# Altium schematic sheet ANALOG-PART.SchDoc: ANALOG SIGNAL DEV-BOARD
size A2; DrawnBy: Luca Schenetti; Revision: V1.0; SheetNumber: 4; SheetTotal: 4
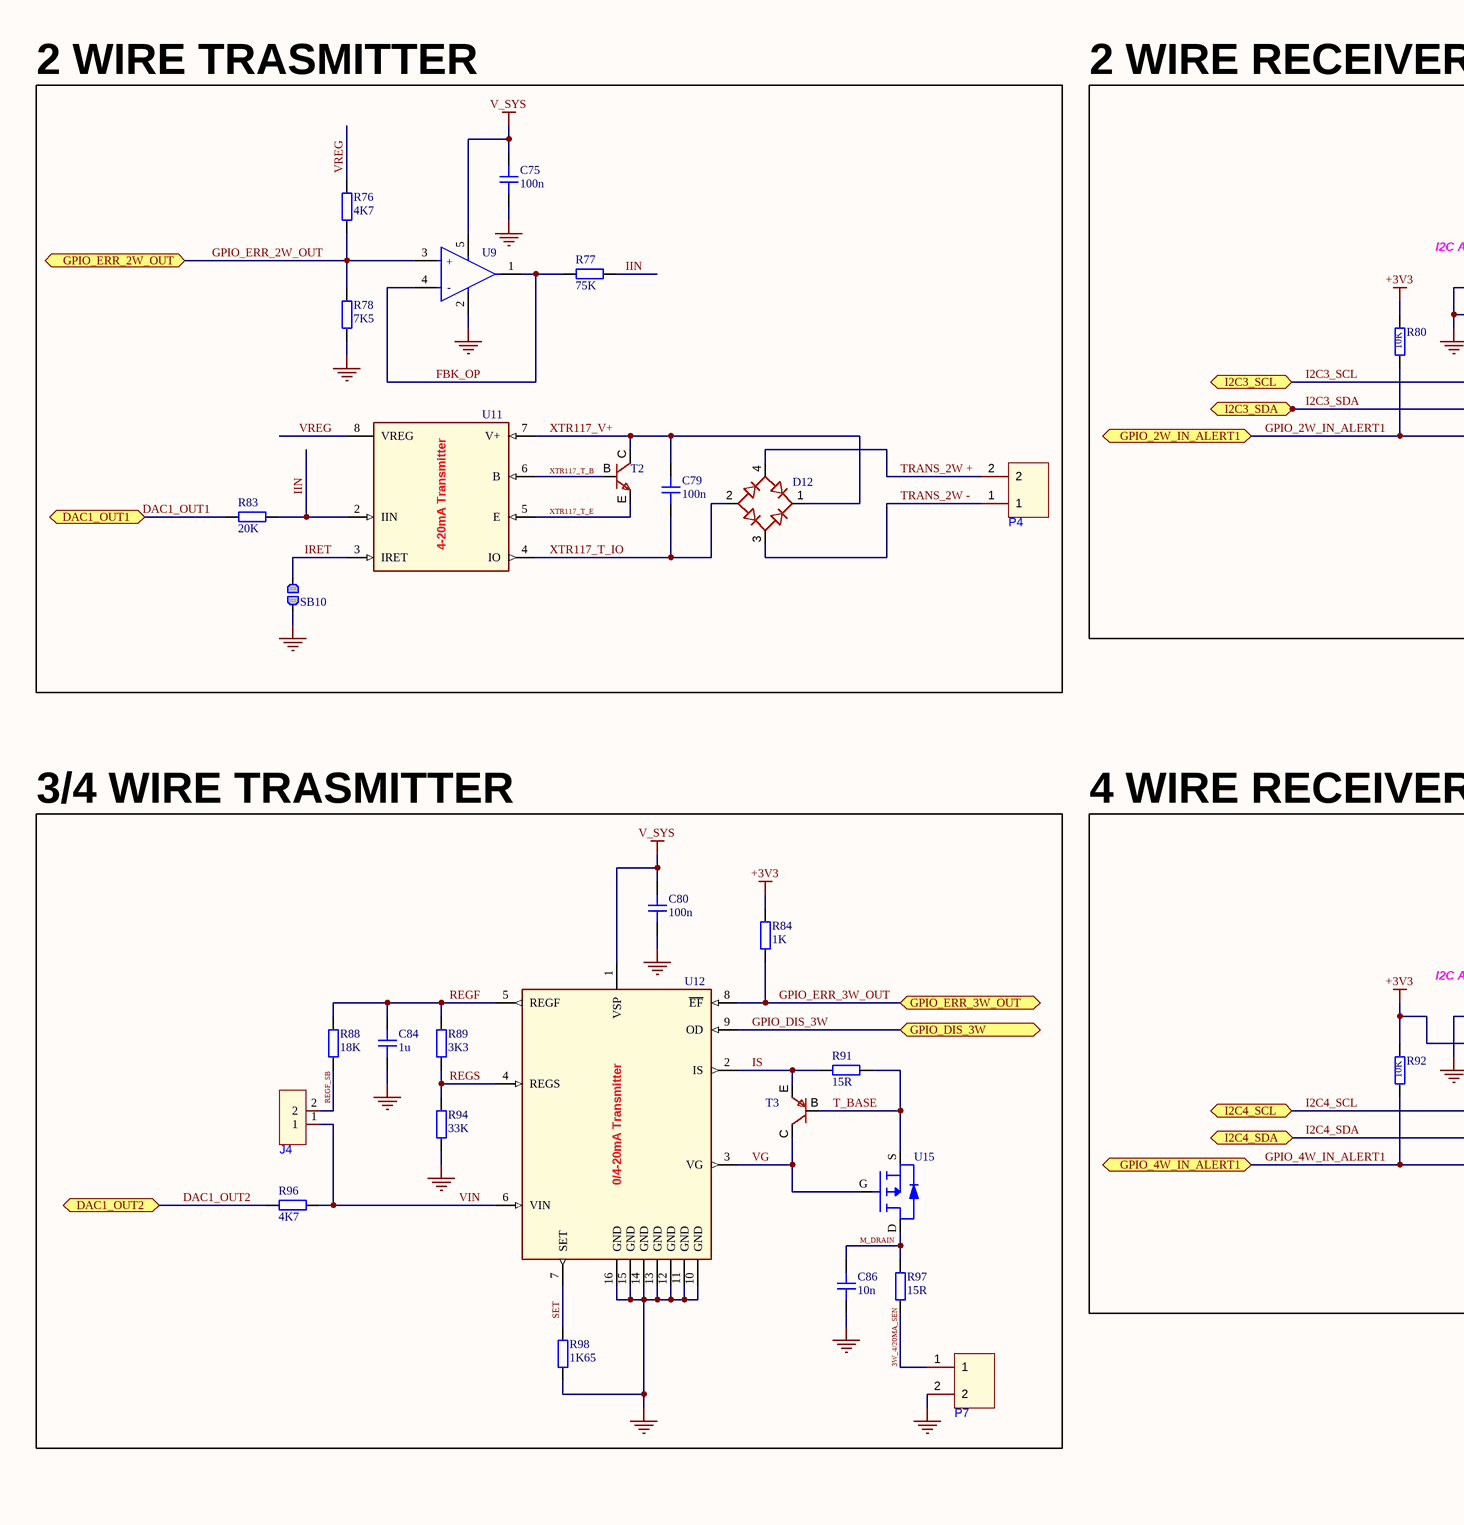
[diagram p0: ANALOG-PART.SchDoc, left]
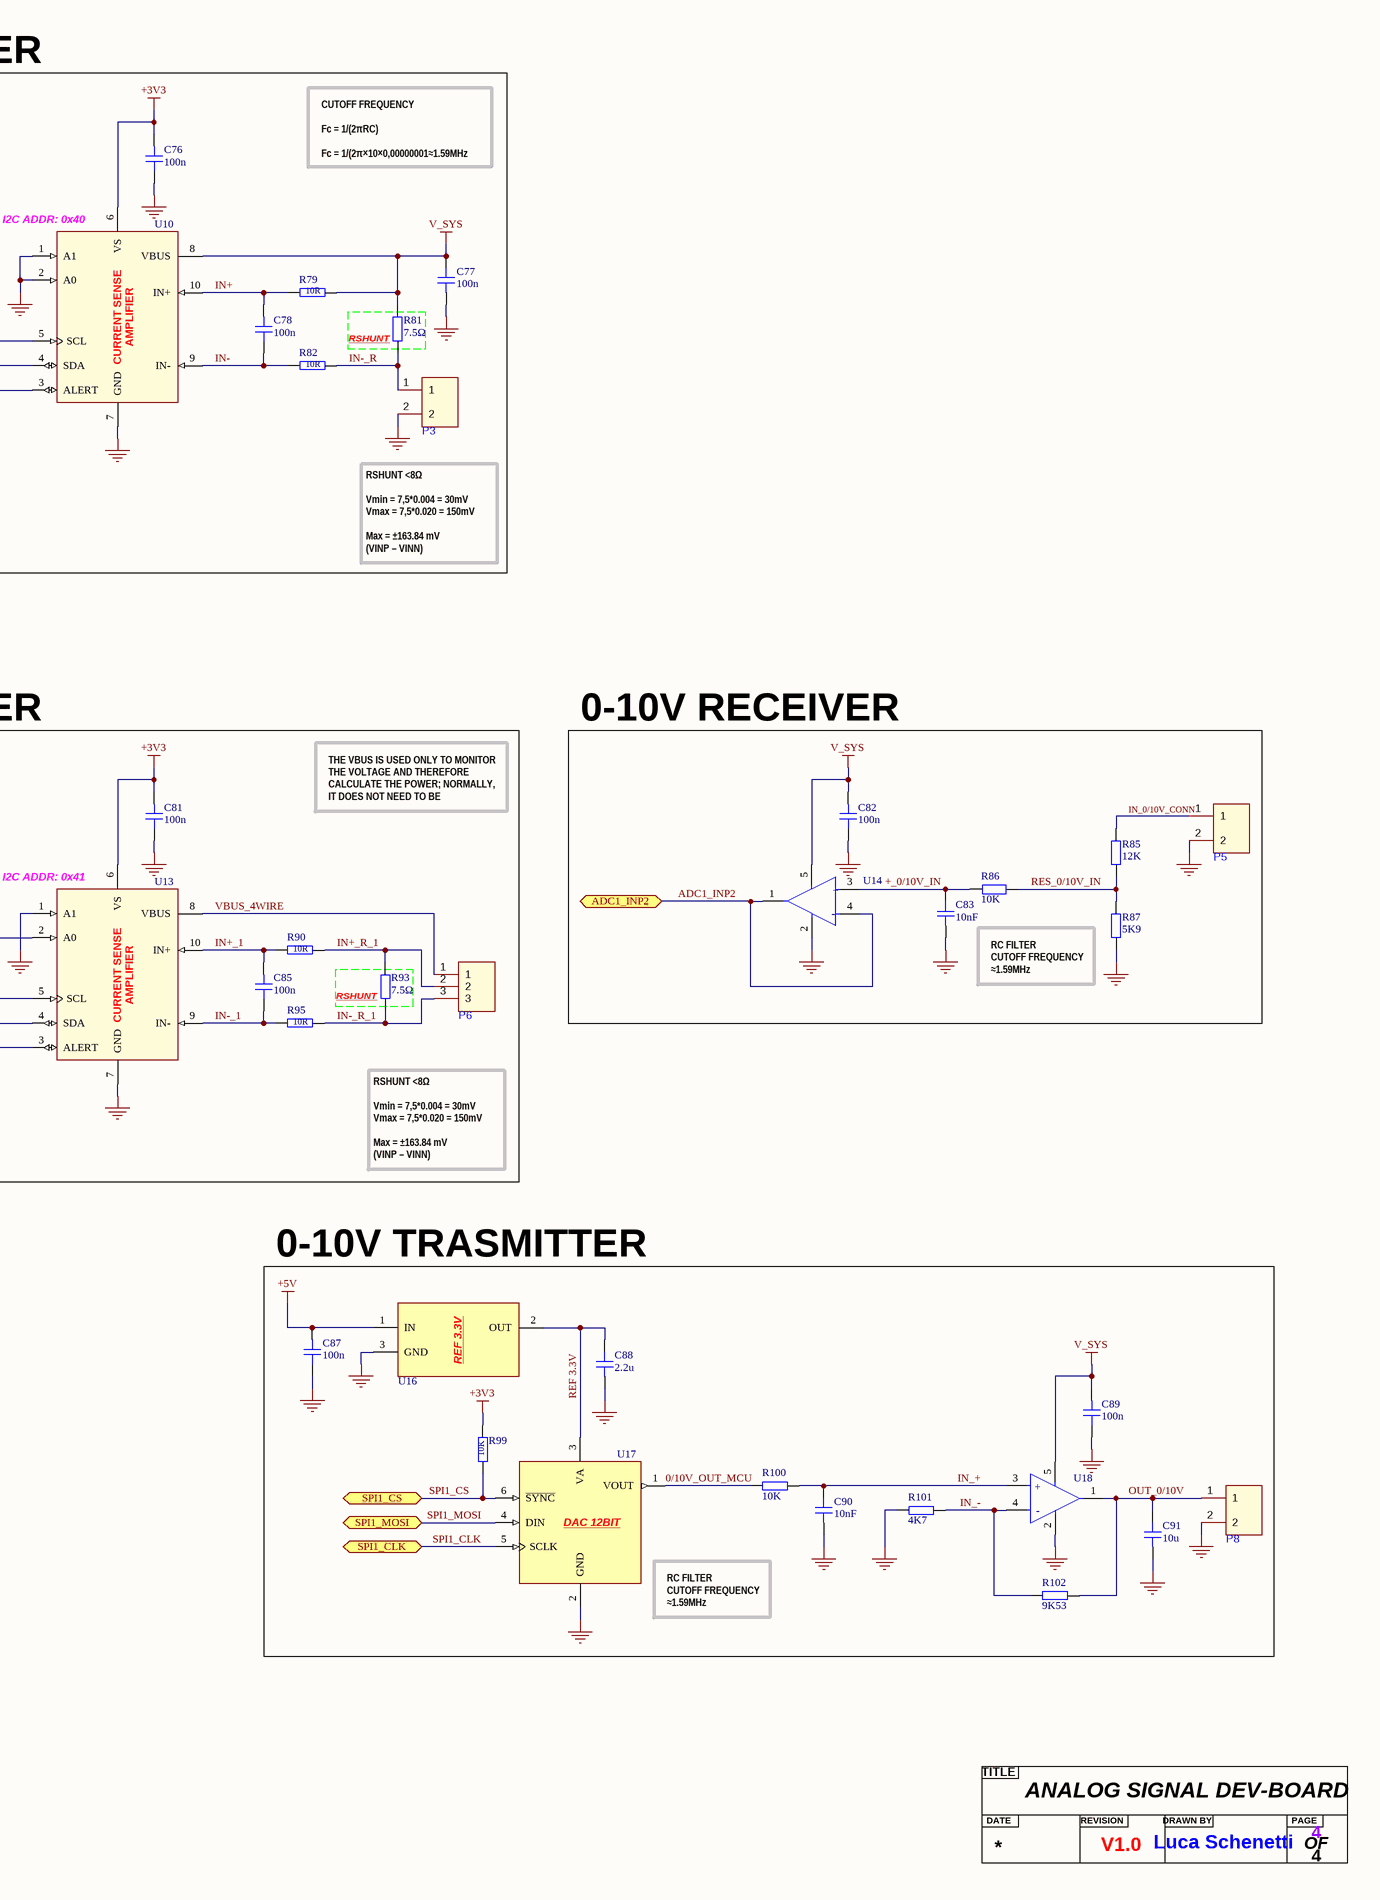
[diagram p1: ANALOG-PART.SchDoc, right]

## Parts
?  Title  (value not drawn)  (graphical)
C75  100n  [CAP_0603]
C76  100n  [CAP_0603]
C77  100n  [CAP_0603]
C78  100n  [CAP_0603]
C79  100n  [CAP_0603]
C80  100n  [CAP_0603]
C81  100n  [CAP_0603]
C82  100n  [CAP_0603]
C83  10nF  [CAP_0603]
C84  1u  [CAP_0603]
C85  100n  [CAP_0603]
C86  10n  [CAP_0603]
C87  100n  [CAP_0603]
C88  2.2u  [CAP_0603]
C89  100n  [CAP_0603]
C90  10nF  [CAP_0603]
C91  10u  [CAP_0603]
D12  MBS Bridge Rectifiers 35A 1.1V  [MB10S]  (value not drawn)
J4  2.54mm 2P  [2.54mm 2P]  (value not drawn)
P3  WJ500V-5.08-2P  [CONN-TH_2P-P5.00_WJ500V-5.08-2P]  (value not drawn)
P4  WJ500V-5.08-2P  [CONN-TH_2P-P5.00_WJ500V-5.08-2P]  (value not drawn)
P5  WJ500V-5.08-2P  [CONN-TH_2P-P5.00_WJ500V-5.08-2P]  (value not drawn)
P6  WJ500V-5.08-3P  [CONN-TH_3P-P5.00_WJ500V-5.08-3P]  (value not drawn)
P7  WJ500V-5.08-2P  [CONN-TH_2P-P5.00_WJ500V-5.08-2P]  (value not drawn)
P8  WJ500V-5.08-2P  [CONN-TH_2P-P5.00_WJ500V-5.08-2P]  (value not drawn)
R76  4K7  [RES_0603]
R77  75K  [RES_0603]
R78  7K5  [RES_0603]
R79  10R  [RES_0603]
R80  10K  [RES_0603]
R81  7.5Ω  [RES_0805]
R82  10R  [RES_0603]
R83  20K  [RES_0603]
R84  1K  [RES_0603]
R85  12K  [RES_0603]
R86  10K  [RES_0603]
R87  5K9  [RES_0603]
R88  18K  [RES_0603]
R89  3K3  [RES_0603]
R90  10R  [RES_0603]
R91  15R  [RES_0603]
R92  10K  [RES_0603]
R93  7.5Ω  [RES_0805]
R94  33K  [RES_0603]
R95  10R  [RES_0603]
R96  4K7  [RES_0603]
R97  15R  [RES_0603]
R98  1K65  [RES_0603]
R99  10K  [RES_0603]
R100  10K  [RES_0603]
R101  4K7  [RES_0603]
R102  9K53  [RES_0603]
SB10  Solderbridge  [Solderbridge]  (value not drawn)  (no BOM)
T2  45V NPN IC = 2A  [FCX690BTA]  (value not drawn)
T3  25V PNP IC = 1,5A  [SS8550]  (value not drawn)
U9  OPA197IDBVR  [FP-DBV0005A-IPC_A]  (value not drawn)
U10  Current Sense Amplifiers  [INA237AIDGSR]  (value not drawn)
U11  4-20mA Current Loop Transmitter  [XTR117AIDGKR]  (value not drawn)
U12  0/4-20mA Current Loop Transmitter  [XTR111AIDGQR]  (value not drawn)
U13  Current Sense Amplifiers  [INA237AIDGSR]  (value not drawn)
U14  OPA197IDBVR  [FP-DBV0005A-IPC_A]  (value not drawn)
U15  P-Channel Mosfet Vds=-60V Vgs=-20V  [SI2309CDS-T1-GE3]  (value not drawn)
U16  REF 3.3V  [REF3033AIDBZR]  (value not drawn)
U17  DAC 12BIT  [DAC121S101CIMK/NOPB]  (value not drawn)
U18  OPA197IDBVR  [FP-DBV0005A-IPC_A]  (value not drawn)

## Blocks framed on the sheet
2 WIRE TRASMITTER: C75 C79 D12 P4 R76-R78 R83 SB10 T2 U9 U11
2 WIRE RECEIVER: C76-C78 P3 R79 R80 R82 U10
RSHUNT: R81
4 WIRE RECEIVER: C81 C85 P6 R90 R92 R95 U13
0-10V RECEIVER: C82 C83 P5 R85-R87 U14
RSHUNT: R93
0-10V TRASMITTER: C87-C91 P8 R99-R102 U16-U18

## Ports
ADC1_INP2 (bidir, see STM32-MCU[3B]), DAC1_OUT1 (bidir, see STM32-MCU[1B]), DAC1_OUT2 (bidir, see STM32-MCU[1B]), GPIO_2W_IN_ALERT1 (bidir, see STM32-MCU[4C]), GPIO_4W_IN_ALERT1 (bidir, see STM32-MCU[4C]), GPIO_DIS_3W (bidir, see STM32-MCU[4C]), GPIO_ERR_2W_OUT (bidir, see STM32-MCU[4C]), GPIO_ERR_3W_OUT (bidir, see STM32-MCU[4C]), I2C3_SCL (bidir, see STM32-MCU[4C]), I2C3_SDA (bidir, see STM32-MCU[4C]), I2C4_SCL (bidir, see STM32-MCU[4B]), I2C4_SDA (bidir, see STM32-MCU[4B]), SPI1_CLK (bidir, see STM32-MCU[4C]), SPI1_CS (bidir, see STM32-MCU[3C]), SPI1_MOSI (bidir, see STM32-MCU[1C])

## Nets
+3V3: C76.1 C81.1 R80.2 R84.2 R92.2 R99.2 U10.6(VS) U13.2(A0) U13.6(VS)
+5V: C87.1 U16.1(IN)
GND: C75.2 C76.2 C77.1 C80.2 C81.2 C82.2 C83.1 C84.2 C86.2 C87.2 C88.1 C89.2 C90.1 C91.1 P3.2 P5.2 P7.2 P8.2 R78.1 R87.1 R94.2 R98.1 R101.1 SB10.1 U9.2(V-) U10.1(A1) U10.2(A0) U10.7(GND) U12.10(GND) U12.11(GND) U12.12(GND) U12.13(GND) U12.14(GND) U12.15(GND) U12.16(GND) U13.1(A1) U13.7(GND) U14.2(V-) U16.3(GND) U17.2(GND) U18.2(V-)
V_SYS: C75.1 C77.2 C80.1 C82.1 C89.1 R79.2 R81.2 U9.5(V+) U10.8(VBUS) U12.1(VSP) U14.5(V+) U18.5(V+)
0/10V_OUT_MCU: R100.1 U17.1(VOUT)
3W_4/20MA_SEN: P7.1 R97.1
+_0/10V_IN: C83.2 R86.2 U14.3(+IN)
ADC1_INP2: U14.1(OUT) U14.4(-IN) ; port ADC1_INP2
DAC1_OUT1: R83.1 ; port DAC1_OUT1
DAC1_OUT2: R96.1 ; port DAC1_OUT2
FBK_OP: R77.1 U9.1(OUT) U9.4(-IN)
GPIO_2W_IN_ALERT1: R80.1 U10.3(ALERT) ; port GPIO_2W_IN_ALERT1
GPIO_4W_IN_ALERT1: R92.1 U13.3(ALERT) ; port GPIO_4W_IN_ALERT1
GPIO_DIS_3W: U12.9(OD) ; port GPIO_DIS_3W
GPIO_ERR_2W_OUT: R76.1 R78.2 U9.3(+IN) ; port GPIO_ERR_2W_OUT
GPIO_ERR_3W_OUT: R84.1 U12.8(~{EF}) ; port GPIO_ERR_3W_OUT
I2C3_SCL: U10.5(SCL) ; port I2C3_SCL
I2C3_SDA: U10.4(SDA) ; port I2C3_SDA
I2C4_SCL: U13.5(SCL) ; port I2C4_SCL
I2C4_SDA: U13.4(SDA) ; port I2C4_SDA
IIN: R77.2 R83.2 U11.2(IIN)
IN+: C78.1 R79.1 U10.10(IN+)
IN+_1: C85.1 R90.1 U13.10(IN+)
IN+_R_1: P6.2 R90.2 R93.2
IN-: C78.2 R82.1 U10.9(IN-)
IN-_1: C85.2 R95.1 U13.9(IN-)
IN-_R: P3.1 R81.1 R82.2
IN-_R_1: P6.3 R93.1 R95.2
IN_0/10V_CONN: P5.1 R85.2
IN_+: C90.2 R100.2 U18.3(+IN)
IN_-: R101.2 R102.1 U18.4(-IN)
IRET: SB10.2 U11.3(IRET)
IS: R91.1 T3.E U12.2(IS)
M_DRAIN: C86.1 R97.2 U15.D
OUT_0/10V: C91.2 P8.1 R102.2 U18.1(OUT)
REF 3.3V: C88.2 U16.2(OUT) U17.3(VA)
REGF: C84.1 R88.2 R89.2 U12.5(REGF)
REGF_SB: J4.2 R88.1
REGS: R89.1 R94.1 U12.4(REGS)
RES_0/10V_IN: R85.1 R86.1 R87.2
SET: R98.2 U12.7(SET)
SPI1_CLK: U17.5(SCLK) ; port SPI1_CLK
SPI1_CS: R99.1 U17.6(~{SYNC}) ; port SPI1_CS
SPI1_MOSI: U17.4(DIN) ; port SPI1_MOSI
T_BASE: R91.2 T3.B U15.S
TRANS_2W +: D12.4(AC1) P4.2
TRANS_2W -: D12.3(AC2) P4.1
VBUS_4WIRE: P6.1 U13.8(VBUS)
VG: T3.C U12.3(VG) U15.G
VIN: J4.1 R96.2 U12.6(VIN)
VREG: R76.2 U11.8(VREG)
XTR117_T_B: T2.B U11.6(B)
XTR117_T_E: T2.E U11.5(E)
XTR117_T_IO: C79.2 D12.2(NEG) U11.4(IO)
XTR117_V+: C79.1 D12.1(POS) T2.C U11.7(V+)

## Notes on the sheet
- CUTOFF FREQUENCY
  Fc = 1/(2πRC)
  Fc = 1/(2π×10×0,00000001≈1.59MHz
- (near U10) I2C ADDR: 0x40
- RSHUNT <8Ω
  Vmin = 7,5*0.004 = 30mV
  Vmax = 7,5*0.020 = 150mV
  Max = ±163.84 mV
  (VINP – VINN)
- 3/4 WIRE TRASMITTER
- THE VBUS IS USED ONLY TO MONITOR THE VOLTAGE AND THEREFORE CALCULATE THE POWER; NORMALLY, IT DOES NOT NEED TO BE CONNECTED.
- (near U13) I2C ADDR: 0x41
- INTERNAL PULL-UP
  CONNECT GND TO DISABLE
- (near R87) RC FILTER
  CUTOFF FREQUENCY
  ≈1.59MHz
- (near U17) RC FILTER
  CUTOFF FREQUENCY
  ≈1.59MHz
- (in symbol CMP-04895-000204-1) +; -
- (in symbol INA237AIDGSR) CURRENT SENSE; AMPLIFIER
- (in symbol Title) TITLE; DATE; REVISION; DRAWN BY; PAGE; OF
- (in symbol XTR111AIDGQR) 0/4-20mA Transmitter
- (in symbol XTR117AIDGKR) 4-20mA Transmitter

## Library data of the parts
C75-C82 C85 C87 C89 = CAP_0603: Capacitor SMD 0603 [C14663]; Manufacturer: *; Manufacturer Part Number: *; Distributor Link: *; LCSC: *; Rating: *; Dielectric: *
C83 C86 C90 = CAP_0603: [C302009]; Manufacturer: *; Manufacturer Part Number: *; Distributor Link: *; LCSC: *; Rating: *; Dielectric: *
C84 = CAP_0603: [C15849]; Manufacturer: *; Manufacturer Part Number: *; Distributor Link: *; LCSC: *; Rating: *; Dielectric: *
C88 = CAP_0603: Capacitor SMD 0603 [C23630]; Manufacturer: *; Manufacturer Part Number: *; Distributor Link: *; LCSC: *; Rating: *; Dielectric: *
C91 = CAP_0603: [C96446]; Manufacturer: *; Manufacturer Part Number: *; Distributor Link: *; LCSC: *; Rating: *; Dielectric: *
D12 = MB10S: [C2488]
J4 = 2.54mm 2P: [C124375]; Manufacturer: Ckmtw(灿科盟); Symbol: 210S-1*2P L=11.6MMGold-plated black; Device: B-2100S02P-A110; Add into BOM: yes; Pin Structure: 1x2P; LCSC Part Name: 间距:2.54mm 1x2P 直插; Supplier Part: C124375; Manufacturer Part: B-2100S02P-A110; Supplier Footprint: 插件,P=2.54mm; JLCPCB Part Class: Extended Part; Datasheet: https://atta.szlcsc.com/upload/public/pdf/source/20221019/2EE72DAC61CAA62C0A53546E211F9C15.pdf; Supplier: LCSC; Convert to PCB: yes; Pitch: 2.54mm; Row Spacing: -; Circluar Pins/Square Pins: -; Mounting Type: Straight; Number of Rows: Plugin; Number of Pins: 2P; Current Rating (Max): -; Voltage Rating (Max): -; Length of Mating Pin: 6mm; Insulation Height: 2.54mm; Length of End Connection Pin: 3mm; Contact Plating: -; Operating Temperature Range: -40℃~+105℃; Color: Black
P3-P5 P7 P8 = WJ500V-5.08-2P: [C8465]; Manufacturer: KANGNEX(康奈克斯电气); Symbol: WJ500V-5.08-2P-14-00A; Add into BOM: yes; Structure: 1x2P; Pitch: 5.08mm; Current Rating (Max): 18A; Voltage Rating (Max): 250V; Wire Gauge - AWG: 14~30; Wire Gauge - mm2: 2.5; Number of PINs Per Row: 2; Screw Specification: M2.5; Device: WJ500V-5.08-2P; LCSC Part Name: 1x2P 5.08mm 直插 排数:1 每排P数:2; Supplier Part: C8465; Manufacturer Part: WJ500V-5.08-2P; Supplier Footprint: 插件,P=5.08mm; JLCPCB Part Class: Extended Part; Datasheet: https://atta.szlcsc.com/upload/public/pdf/source/20191225/C8465_02D34CE5B5B4A53DF5891601D97FA9F4.pdf; Supplier: LCSC; Convert to PCB: yes; Color: Green; Mounting Style: Straight; Number of Pins: 2P; Number of Rows: 1; Contact Material: -; Contact Plating: -; Operating Temperature Range: -40℃~+105℃; Soldering Temperature(Max): -
P6 = WJ500V-5.08-3P: [C72334]; Manufacturer: KANGNEX(康奈克斯电气); Symbol: WJ500V-5.08-3P-14-00A; Add into BOM: yes; Structure: 1x3P; Pitch: 5.08mm; Current Rating (Max): 18A; Voltage Rating (Max): 250V; Wire Gauge - AWG: 14~30; Wire Gauge - mm2: 2.5; Number of PINs Per Row: 3; Device: WJ500V-5.08-3P; LCSC Part Name: 5.08mm 1x3P 排数:1 每排P数:3 直插; Supplier Part: C72334; Manufacturer Part: WJ500V-5.08-3P; Supplier Footprint: 插件,P=5.08mm; JLCPCB Part Class: Extended Part; Datasheet: https://atta.szlcsc.com/upload/public/pdf/source/20191225/C72334_8A5EF831D67650233B6B1E3F2BC06274.pdf; Supplier: LCSC; Convert to PCB: yes; Color: Green; Mounting Style: Straight; Number of Pins: 3P; Number of Rows: 1; Operating Temperature Range: -40℃~+105℃
R76 R101 = RES_0603: [C105428]; Manufacturer: *; Manufacturer Part Number: *; Distributor Link: *; LCSC: *
R77 = RES_0603: [C23242]; Manufacturer: *; Manufacturer Part Number: *; Distributor Link: *; LCSC: *
R78 = RES_0603: [C23234]; Manufacturer: *; Manufacturer Part Number: *; Distributor Link: *; LCSC: *
R79 R82 R90 R95 = RES_0603: Resistor SMD 0603 [C22859]; Manufacturer: *; Manufacturer Part Number: *; Distributor Link: *; LCSC: *
R80 R86 R92 R99 R100 = RES_0603: [C25804]; Manufacturer: *; Manufacturer Part Number: *; Distributor Link: *; LCSC: *
R81 R93 = RES_0805: [C2828733]; Manufacturer: *; Manufacturer Part Number: *; Distributor Link: *; LCSC: *
R83 = RES_0603: [C4184]; Manufacturer: *; Manufacturer Part Number: *; Distributor Link: *; LCSC: *
R84 = RES_0603: [C21190]; Manufacturer: *; Manufacturer Part Number: *; Distributor Link: *; LCSC: *
R85 = RES_0603: [C326735]; Manufacturer: *; Manufacturer Part Number: *; Distributor Link: *; LCSC: *
R87 = RES_0603: [C491142]; Manufacturer: *; Manufacturer Part Number: *; Distributor Link: *; LCSC: *
R88 = RES_0603: [C309650]; Manufacturer: *; Manufacturer Part Number: *; Distributor Link: *; LCSC: *
R89 = RES_0603: [C22978]; Manufacturer: *; Manufacturer Part Number: *; Distributor Link: *; LCSC: *
R91 R97 = RES_0603: [C22810]; Manufacturer: *; Manufacturer Part Number: *; Distributor Link: *; LCSC: *
R94 = RES_0603: [C4216]; Manufacturer: *; Manufacturer Part Number: *; Distributor Link: *; LCSC: *
R96 = RES_0603: [C99782]; Manufacturer: *; Manufacturer Part Number: *; Distributor Link: *; LCSC: *
R98 = RES_0603: [C22845]; Manufacturer: *; Manufacturer Part Number: *; Distributor Link: *; LCSC: *
R102 = RES_0603: [C2960722]; Manufacturer: *; Manufacturer Part Number: *; Distributor Link: *; LCSC: *
T2 = FCX690BTA: [C460072]
T3 = SS8550: [C7420371]
U9 = CMP-04895-000204-1: IC OPAMP GP 1 CIRCUIT SOT23-5 [C221351]; Number of Circuits: 1; Operating Supply Current: 1mA; Input Offset Voltage (Vos): 25uV; Slew Rate: 20V/µs; Output Current per Channel: 65mA; Input Bias Current: 5pA; Gain Bandwidth Product: 10MHz; RoHS Compliant: Yes; Max Operating Temperature: 125°C; Packaging: Tape and Reel; Number of Channels: 1; Min Operating Temperature: -40°C; Lead Free: Lead Free; Case/Package: SOT-23-5; Mount: Surface Mount
U10 U13 = INA237AIDGSR: [C2864837]
U11 = XTR117AIDGKR: [C140927]
U12 = XTR111AIDGQR: [C26350]
U14 U18 = CMP-04895-000204-1: [C221351]; Number of Circuits: 1; Operating Supply Current: 1mA; Input Offset Voltage (Vos): 25uV; Slew Rate: 20V/µs; Output Current per Channel: 65mA; Input Bias Current: 5pA; Gain Bandwidth Product: 10MHz; RoHS Compliant: Yes; Max Operating Temperature: 125°C; Packaging: Tape and Reel; Number of Channels: 1; Min Operating Temperature: -40°C; Lead Free: Lead Free; Case/Package: SOT-23-5; Mount: Surface Mount
U15 = SI2309CDS-T1-GE3: [C5350873]
U16 = REF3033AIDBZR: [C36658]
U17 = DAC121S101CIMK/NOPB: [C81724]
SB10 = Solderbridge: Value: Solderbridge